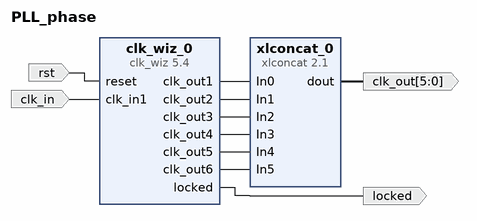
[diagram p0: block diagram of the top level]
# Vivado block design PLL_phase, xc7z020clg484-1, Vivado 2017.4
create_bd_design PLL_phase

create_bd_port -dir I rst
create_bd_port -dir I clk_in
create_bd_port -dir O locked
create_bd_port -dir O -from 5 -to 0 clk_out

create_bd_cell -type ip -vlnv xilinx.com:ip:clk_wiz:5.4 clk_wiz_0
set_property -dict [list \
  CONFIG.PRIMITIVE PLL \
  CONFIG.JITTER_SEL No_Jitter \
  CONFIG.PRIM_IN_FREQ 50 \
  CONFIG.CLKIN1_JITTER_PS 200.0 \
  CONFIG.CLKOUT2_USED true \
  CONFIG.CLKOUT3_USED true \
  CONFIG.CLKOUT4_USED true \
  CONFIG.CLKOUT5_USED true \
  CONFIG.CLKOUT6_USED true \
  CONFIG.NUM_OUT_CLKS 6 \
  CONFIG.CLKOUT1_REQUESTED_OUT_FREQ 50 \
  CONFIG.CLKOUT2_REQUESTED_OUT_FREQ 50 \
  CONFIG.CLKOUT2_REQUESTED_PHASE 60 \
  CONFIG.CLKOUT3_REQUESTED_OUT_FREQ 50 \
  CONFIG.CLKOUT3_REQUESTED_PHASE 120 \
  CONFIG.CLKOUT4_REQUESTED_OUT_FREQ 50 \
  CONFIG.CLKOUT4_REQUESTED_PHASE 180 \
  CONFIG.CLKOUT5_REQUESTED_OUT_FREQ 50 \
  CONFIG.CLKOUT5_REQUESTED_PHASE 240 \
  CONFIG.CLKOUT6_REQUESTED_OUT_FREQ 50 \
  CONFIG.CLKOUT6_REQUESTED_PHASE 300 \
  CONFIG.CLKOUT1_DRIVES BUFG \
  CONFIG.CLKOUT2_DRIVES BUFG \
  CONFIG.CLKOUT3_DRIVES BUFG \
  CONFIG.CLKOUT4_DRIVES BUFG \
  CONFIG.CLKOUT5_DRIVES BUFG \
  CONFIG.CLKOUT6_DRIVES BUFG \
  CONFIG.CLKOUT7_DRIVES BUFG \
  CONFIG.MMCM_DIVCLK_DIVIDE 1 \
  CONFIG.MMCM_BANDWIDTH OPTIMIZED \
  CONFIG.MMCM_CLKFBOUT_MULT_F 18 \
  CONFIG.MMCM_CLKIN1_PERIOD 20.000 \
  CONFIG.MMCM_CLKIN2_PERIOD 10.0 \
  CONFIG.MMCM_COMPENSATION ZHOLD \
  CONFIG.MMCM_CLKOUT0_DIVIDE_F 18 \
  CONFIG.MMCM_CLKOUT1_DIVIDE 18 \
  CONFIG.MMCM_CLKOUT1_PHASE 60.000 \
  CONFIG.MMCM_CLKOUT2_DIVIDE 18 \
  CONFIG.MMCM_CLKOUT2_PHASE 120.000 \
  CONFIG.MMCM_CLKOUT3_DIVIDE 18 \
  CONFIG.MMCM_CLKOUT3_PHASE 180.000 \
  CONFIG.MMCM_CLKOUT4_DIVIDE 18 \
  CONFIG.MMCM_CLKOUT4_PHASE 240.000 \
  CONFIG.MMCM_CLKOUT5_DIVIDE 18 \
  CONFIG.MMCM_CLKOUT5_PHASE 300.000 \
  CONFIG.CLKOUT1_JITTER 210.144 \
  CONFIG.CLKOUT1_PHASE_ERROR 161.614 \
  CONFIG.CLKOUT2_JITTER 210.144 \
  CONFIG.CLKOUT2_PHASE_ERROR 161.614 \
  CONFIG.CLKOUT3_JITTER 210.144 \
  CONFIG.CLKOUT3_PHASE_ERROR 161.614 \
  CONFIG.CLKOUT4_JITTER 210.144 \
  CONFIG.CLKOUT4_PHASE_ERROR 161.614 \
  CONFIG.CLKOUT5_JITTER 210.144 \
  CONFIG.CLKOUT5_PHASE_ERROR 161.614 \
  CONFIG.CLKOUT6_JITTER 210.144 \
  CONFIG.CLKOUT6_PHASE_ERROR 161.614 \
] [get_bd_cells clk_wiz_0]
create_bd_cell -type ip -vlnv xilinx.com:ip:xlconcat:2.1 xlconcat_0
set_property -dict {CONFIG.NUM_PORTS 6} [get_bd_cells xlconcat_0]

# ---- connections ----

connect_bd_net [get_bd_ports rst] [get_bd_pins clk_wiz_0/reset]
connect_bd_net [get_bd_ports clk_in] [get_bd_pins clk_wiz_0/clk_in1]
connect_bd_net [get_bd_pins clk_wiz_0/locked] [get_bd_ports locked]
connect_bd_net [get_bd_pins clk_wiz_0/clk_out1] [get_bd_pins xlconcat_0/In0]
connect_bd_net [get_bd_pins clk_wiz_0/clk_out2] [get_bd_pins xlconcat_0/In1]
connect_bd_net [get_bd_pins clk_wiz_0/clk_out3] [get_bd_pins xlconcat_0/In2]
connect_bd_net [get_bd_pins clk_wiz_0/clk_out4] [get_bd_pins xlconcat_0/In3]
connect_bd_net [get_bd_pins clk_wiz_0/clk_out5] [get_bd_pins xlconcat_0/In4]
connect_bd_net [get_bd_pins clk_wiz_0/clk_out6] [get_bd_pins xlconcat_0/In5]
connect_bd_net [get_bd_pins xlconcat_0/dout] [get_bd_ports clk_out]

validate_bd_design
save_bd_design
